# Altium schematic sheet USB Device.SchDoc: USB ABCDE
size A3; Date: 2015/04/02; Author: QWER
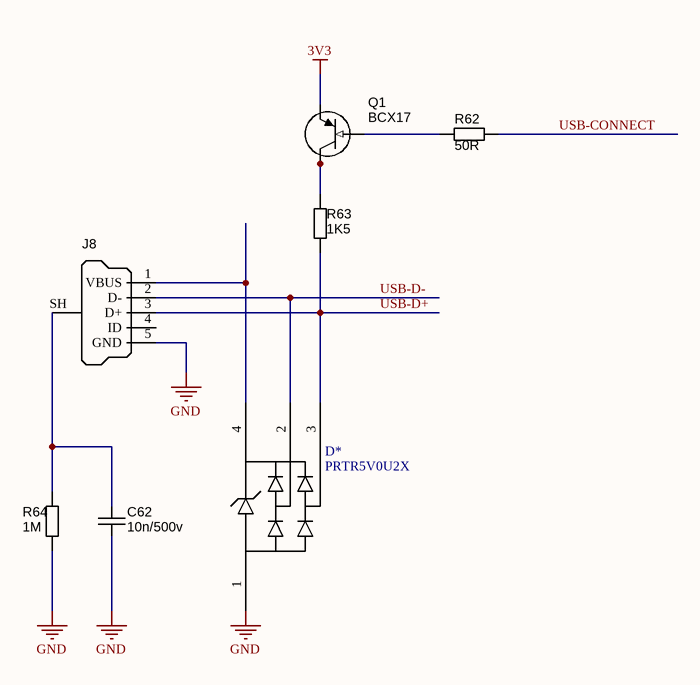
[diagram p0: USB Device.SchDoc]

## Parts
C62  value 10n/500v  [CAPC2012N]  (hidden comment: approved sub OK)
D*  PRTR5V0U2X
J8  USB Micro Type B  [USB_Micro-B_FCI_SMD]  (value not drawn)
Q1  Manufacturer Part Number 1: BCX17  [SOT23_213]  (hidden comment: PNP)
R62  value 50R  [RESC1005N]  (hidden comment: Thick Film)
R63  value 1K5  [RESC1005N]  (hidden comment: Thick Film)
R64  value 1M  [RESC1005N]  (hidden comment: Thick Film)

## Nets
3V3: Q1.3(E)
GND: C62.2 D*.1(GND) J8.5(GND) R64.1
USB-CONNECT: R62.1
USB-D+: D*.3(I/O_2) J8.3(D+) R63.2
USB-D-: D*.2(I/O_1) J8.2(D-)
NetC62_1: C62.1 J8.SH(Shell) R64.2
NetD*_4: D*.4(VCC) J8.1(VBUS)
NetQ1_1: Q1.1(B) R62.2
NetQ1_2: Q1.2(C) Q1.4(C) R63.1

Not connected (* = marked no-connect by the designer): J8 4(ID)

## Library data of the parts
C62 = CAPC_100n_0805: Capacitor SMD Cer 100nF 10% 50V X7R 0805; Manufacturer 1: Kemet; Manufacturer Part Number 1: C0805C104K5RACTU; Tolerance: ?0%; Ratings: 50V; X7R; Material: ceramic; Package / Case: 0805 (2012 metric); Supplier 1: Digi-Key; Supplier Part Number 1: 399-1170-1-ND
J8 = USB_Micro_TypeB_FCI: Connector SMD-THD USB Micro Type B middle mount; Manufacturer 1: FCI; Manufacturer Part Number 1: 10103593-0001LF; Package / Case: SMD/THD mid-mount; Supplier 1: Digi-Key; Supplier Part Number 1: 609-4049-1-ND
Q1 = PNP_NSS60600MZ4T1G: Transistor SMD PNP 60V 6A 800mW SOT-223; Manufacturer 1: ON Semiconductor; Ratings: 60V; 6A; 800mW; Material: Si; Package / Case: SOT-223; Transistor Type: PNP; Mounting Type: Surface Mount; Supplier 1: Digi-Key; Supplier Part Number 1: NSS60600MZ4T1GOSCT-ND
R62-R64 = RES_330R_0402_5%: Resistor SMD chip 330 Ohm 0.063W 5% 0402; Manufacturer 1: Yageo; Manufacturer Part Number 1: RC0402JR-07330RL; Ratings: 1/16 W; Tolerance: ?%; Package / Case: 0402 (1005 Metric); Supplier 1: Digi-Key; Supplier Part Number 1: 311-330JRCT-ND; ComponentLink1URL: http://www.yageo.com/documents/recent/PYu-RC0402_51_RoHS_L_6.pdf; ComponentLink1Description: http://www.yageo.com/documents/recent/PYu-RC0402_51_RoHS_L_6.pdf